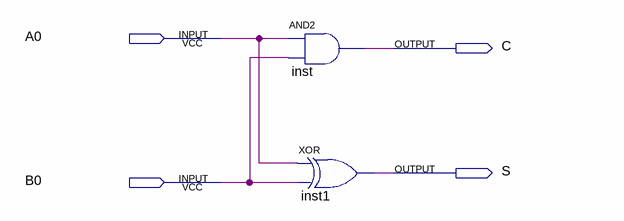
[diagram p0: schematic sheet]
// Quartus schematic ha.bdf as structural Verilog: 2 symbols, 4 pins
module ha (
  input  A0,
  input  B0,
  output C,
  output S
);

  and inst (C, A0, B0);
  xor inst1 (S, A0, B0);
endmodule
